# EAGLE design MobileArcade (EAGLE 9.2.1)
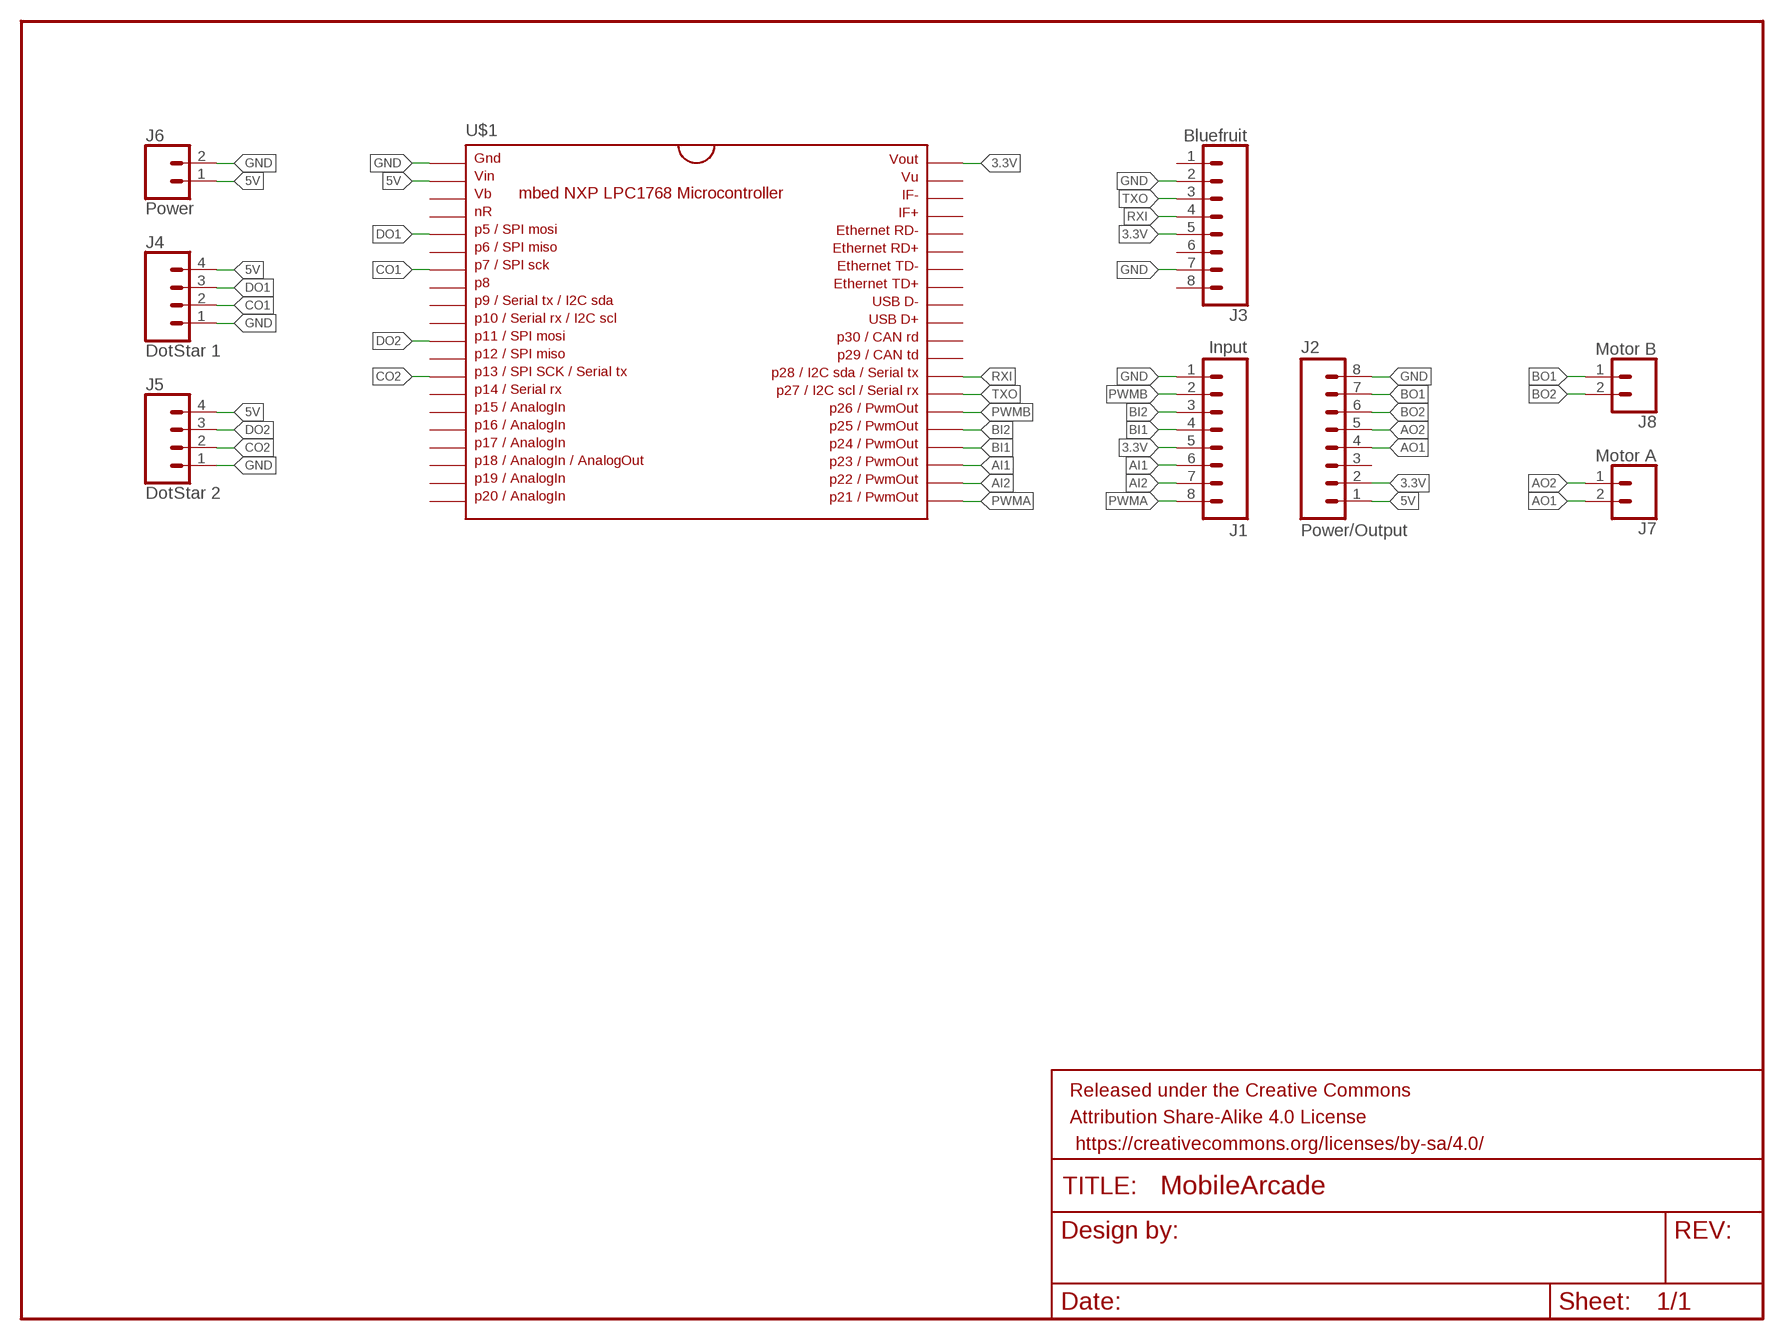
[diagram p0: schematic, sheet 1]

## Parts
FRAME1  FRAME-LETTERNO_PACKAGE  [DUMMY]
J1  Input  CONN_08"  [1X08]
J2  Power/Output  CONN_08"  [1X08]
J3  Bluefruit  CONN_08"  [1X08]
J4  DotStar 1  CONN_04  [1X04]
J5  DotStar 2  CONN_04  [1X04]
J6  Power  CONN_02  [1X02]
J7  Motor A  CONN_02  [1X02]
J8  Motor B  CONN_02  [1X02]
U$1  MBED1768  MBED_NXP_LPC1768  [DIL40_0.9]

## Nets
3.3V: J1.5 J2.2 J3.5 U$1.40
5V: J2.1 J4.4 J5.4 J6.1 U$1.2
AI1: J1.6 U$1.23
AI2: J1.7 U$1.22
AO1: J2.4 J7.2
AO2: J2.5 J7.1
BI1: J1.4 U$1.24
BI2: J1.3 U$1.25
BO1: J2.7 J8.1
BO2: J2.6 J8.2
CO1: J4.2 U$1.7
CO2: J5.2 U$1.13
DO1: J4.3 U$1.5
DO2: J5.3 U$1.11
GND: J1.1 J2.8 J3.2 J3.7 J4.1 J5.1 J6.2 U$1.1
PWMA: J1.8 U$1.21
PWMB: J1.2 U$1.26
RXI: J3.4 U$1.28
TXO: J3.3 U$1.27
Unconnected: J2.3 J3.1 J3.6 J3.8 U$1.3 U$1.4 U$1.6 U$1.8 U$1.9 U$1.10 U$1.12 U$1.14 U$1.15 U$1.16 U$1.17 U$1.18 U$1.19 U$1.20 U$1.29 U$1.30 U$1.31 U$1.32 U$1.33 U$1.34 U$1.35 U$1.36 U$1.37 U$1.38 U$1.39

## Library data of the parts
FRAME1 = SparkFun-Aesthetics:FRAME-LETTER: Schematic Frame - Letter Standard 8.5x11 US Letter frame; DESIGNER: Nobody; VERSION: v01
J1-J3 = SparkFun-Connectors:CONN_08: Multi connection point. Often used as Generic Header-pin footprint for 0.1 inch spaced/style header connections On any of the 0.1 inch spaced packages, you can populate with these: Break Away Headers - Straight <https://www.sparkfun.com/products/116> (PRT-00116) Break Away Male Headers - Right Angle <https://www.sparkfun.com/products/553> (PRT-00553) Female Headers <https://www.sparkfun.com/products/115> (PRT-00115) Break Away Headers - Machine Pin <https://www.sparkfun.com/products/117> (PRT-00117) Break Away Female Headers - Swiss Machine Pin <https://www.sparkfun.com/products/743> (PRT-00743) Arduino Stackable Header - 8 Pin <https://www.sparkfun.com/products/9279> (PRT-09279) For SCREWTERMINALS and SPRING TERMINALS visit here: Screw Terimnals on SparkFun.com <https://www.sparkfun.com/search/results?term=Screw+Terminals> (5mm/3.5mm/2.54mm spacing) This device is also useful as a general connection point to wire up your design to another part of your project. Our various solder wires solder well into these plated through hole pads. Hook-Up Wire - Assortment (Stranded, 22 AWG) <https://www.sparkfun.com/products/11375> (PRT-11375) Hook-Up Wire - Assortment (Solid Core, 22 AWG) <https://www.sparkfun.com/products/11367> (PRT-11367) View the entire wire category on our website here <https://www.sparkfun.com/categories/141> Special notes: Molex polarized connector foot print use with SKU : PRT-08231 with associated crimp pins and housings. 1MM SMD Version SKU: PRT-10208 NOTES ON THE VARIANTS LOCK and LOCK_LONGPADS... This footprint was designed to help hold the alignment of a through-hole component (i.e. 6-pin header) while soldering it into place. You may notice that each hole has been shifted either up or down by 0.005 of an inch from it's more standard position (which is a perfectly straight line). This slight alteration caused the pins (the squares in the middle) to touch the edges of the holes. Because they are alternating, it causes a "brace" to hold the component in place. 0.005 has proven to be the perfect amount of "off-center" position when using our standard breakaway headers. Although looks a little odd when you look at the bare footprint, once you have a header in there, the alteration is very hard to notice. Also,if you push a header all the way into place, it is covered up entirely on the bottom side.; PROD_ID: CONN-08438
J4 J5 = SparkFun-Connectors:CONN_04: Multi connection point. Often used as Generic Header-pin footprint for 0.1 inch spaced/style header connections On any of the 0.1 inch spaced packages, you can populate with these: Break Away Headers - Straight <https://www.sparkfun.com/products/116> (PRT-00116) Break Away Male Headers - Right Angle <https://www.sparkfun.com/products/553> (PRT-00553) Female Headers <https://www.sparkfun.com/products/115> (PRT-00115) Break Away Headers - Machine Pin <https://www.sparkfun.com/products/117> (PRT-00117) Break Away Female Headers - Swiss Machine Pin <https://www.sparkfun.com/products/743> (PRT-00743) For SCREWTERMINALS and SPRING TERMINALS visit here: Screw Terimnals on SparkFun.com <https://www.sparkfun.com/search/results?term=Screw+Terminals> (5mm/3.5mm/2.54mm spacing) This device is also useful as a general connection point to wire up your design to another part of your project. Our various solder wires solder well into these plated through hole pads. Hook-Up Wire - Assortment (Stranded, 22 AWG) <https://www.sparkfun.com/products/11375> (PRT-11375) Hook-Up Wire - Assortment (Solid Core, 22 AWG) <https://www.sparkfun.com/products/11367> (PRT-11367) View the entire wire category on our website here <https://www.sparkfun.com/categories/141> Special notes: Molex polarized connector foot print use with SKU : PRT-08231 with associated crimp pins and housings. 1MM SMD Version SKU: PRT-10208; PROD_ID: CONN-09696
J6-J8 = SparkFun-Connectors:CONN_02: Multi connection point. Often used as Generic Header-pin footprint for 0.1 inch spaced/style header connections On any of the 0.1 inch spaced packages, you can populate with these: Break Away Headers - Straight <https://www.sparkfun.com/products/116> (PRT-00116) Break Away Male Headers - Right Angle <https://www.sparkfun.com/products/553> (PRT-00553) Female Headers <https://www.sparkfun.com/products/115> (PRT-00115) Break Away Headers - Machine Pin <https://www.sparkfun.com/products/117> (PRT-00117) Break Away Female Headers - Swiss Machine Pin <https://www.sparkfun.com/products/743> (PRT-00743) For SCREWTERMINALS and SPRING TERMINALS visit here: Screw Terimnals on SparkFun.com <https://www.sparkfun.com/search/results?term=Screw+Terminals> (5mm/3.5mm/2.54mm spacing) This device is also useful as a general connection point to wire up your design to another part of your project. Our various solder wires solder well into these plated through hole pads. Hook-Up Wire - Assortment (Stranded, 22 AWG) <https://www.sparkfun.com/products/11375> (PRT-11375) Hook-Up Wire - Assortment (Solid Core, 22 AWG) <https://www.sparkfun.com/products/11367> (PRT-11367) View the entire wire category on our website here <https://www.sparkfun.com/categories/141> Special notes: Molex polarized connector foot print use with: PRT-08233 with associated crimp pins and housings. 2.54_SCREWTERM for use with PRT-10571. 3.5mm Screw Terminal footprints for PRT-08084 5mm Screw Terminal footprints for use with PRT-08432
U$1 = SparkFun-Boards:MBED_NXP_LPC1768: mbed LPC1768 board footprint Boards using this footprint: mbed - LPC1768 (Cortex-M3) (DEV-09564); PROD_ID: COMP-12167

## Board
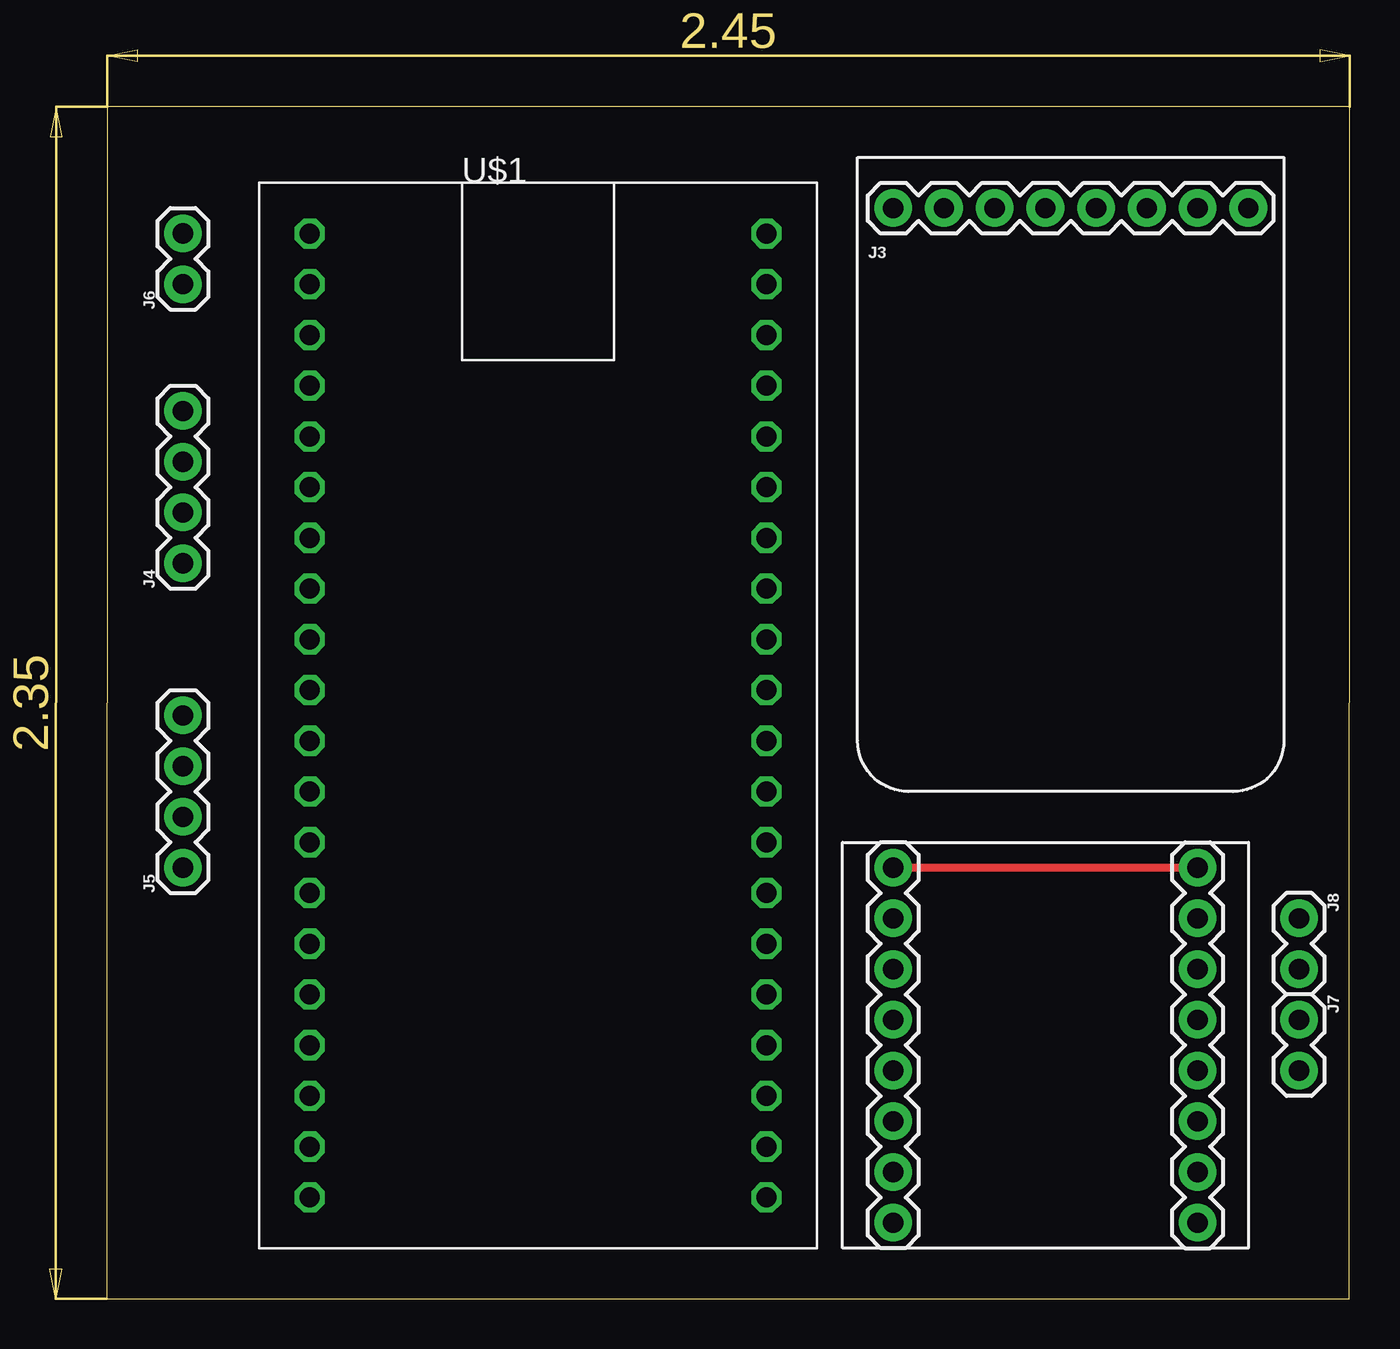
[diagram p1: board, top side]
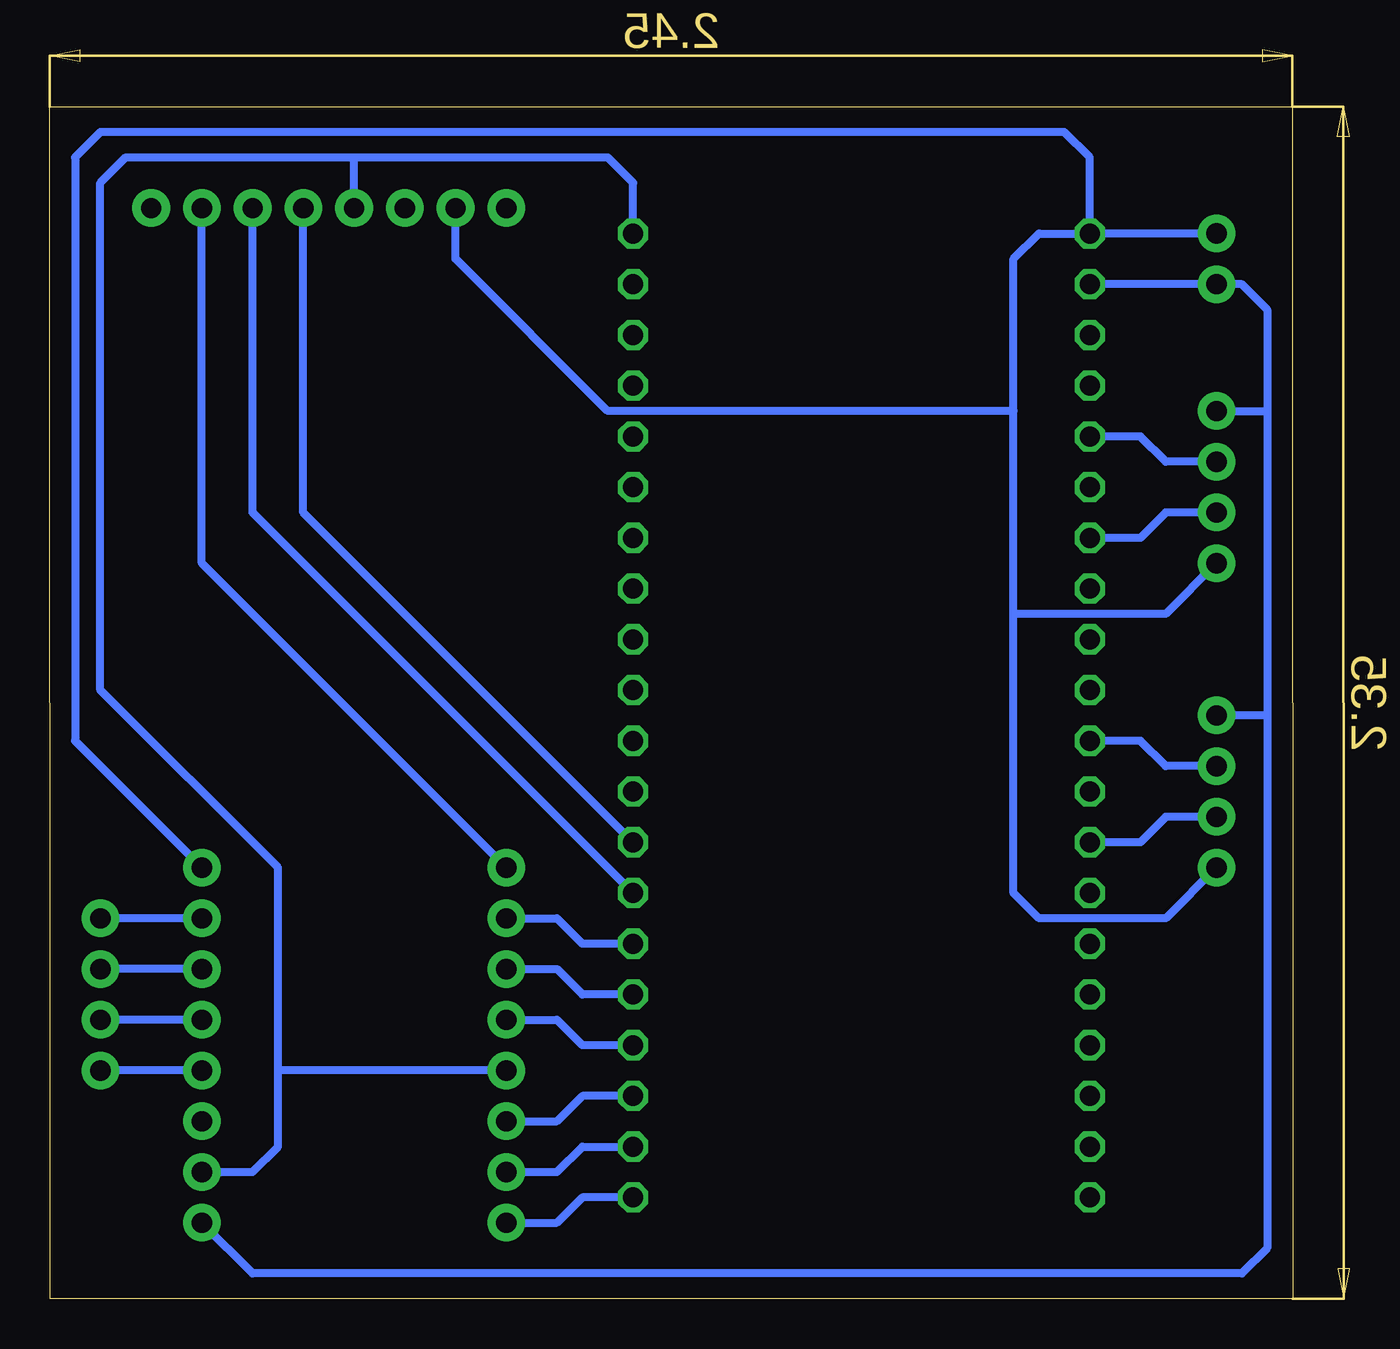
[diagram p2: board, bottom side, seen from below]

Size 62.22 x 59.69 mm. Coordinates in mm from the lower left corner, seen from the top.
Outline: 0,0 62.21,0 62.22,59.69 0.01,59.69 0,0
Copper layers (1*16): Top 0.035mm / dielectric 1.5mm / Bottom 0.035mm
Design rules "default": minimum track width 6mil, minimum drill 0.35mm, track to track 6mil, track to pad 6mil, pad to pad 6mil, via to via 6mil, smd to smd 6mil, copper to edge 40mil, drill to drill 6mil, minimum pad ring 10mil, minimum via ring 8mil, stop-mask expansion 4mil, vias tented up to drill 0mil, thermal gap 10mil

### Footprints (pad centres in the part's own frame; a part is rotated, then mirrored left to right if it is on the bottom)
1X08 = drill 1.016 pad 1.88: 1 0,0; 2 2.54,0; 3 5.08,0; 4 7.62,0; 5 10.16,0; 6 12.7,0; 7 15.24,0; 8 17.78,0
1X04 = drill 1.016 pad 1.88: 1 0,0; 2 2.54,0; 3 5.08,0; 4 7.62,0
1X02 = drill 1.016 pad 1.88: 1 0,0; 2 2.54,0
DIL40_0.9 = drill 1 pad 1.397 octagon: 1 -22.86,-11.43; 2 -20.32,-11.43; 3 -17.78,-11.43; 4 -15.24,-11.43; 5 -12.7,-11.43; 6 -10.16,-11.43; 7 -7.62,-11.43; 8 -5.08,-11.43; 9 -2.54,-11.43; 10 0,-11.43; 11 2.54,-11.43; 12 5.08,-11.43; 13 7.62,-11.43; 14 10.16,-11.43; 15 12.7,-11.43; 16 15.24,-11.43; 17 17.78,-11.43; 18 20.32,-11.43; 19 22.86,-11.43; 20 25.4,-11.43; 21 25.4,11.43; 22 22.86,11.43; 23 20.32,11.43; 24 17.78,11.43; 25 15.24,11.43; 26 12.7,11.43; 27 10.16,11.43; 28 7.62,11.43; 29 5.08,11.43; 30 2.54,11.43; 31 0,11.43; 32 -2.54,11.43; 33 -5.08,11.43; 34 -7.62,11.43; 35 -10.16,11.43; 36 -12.7,11.43; 37 -15.24,11.43; 38 -17.78,11.43; 39 -20.32,11.43; 40 -22.86,11.43

### Placement (x,y rotation side)
FRAME1  5.08,1.27 0 top
J1  39.37,21.59 270 top
J2  54.61,3.81 90 top
J3  57.15,54.61 180 top
J4  3.81,36.83 90 top
J5  3.81,21.59 90 top
J6  3.81,50.8 90 top
J7  59.69,13.97 270 top
J8  59.69,19.05 270 top
U$1  21.59,30.48 270 top

### Tracks (layer width: path | path; a pad name or v marks a point on that pad's centre or on a via)
3.3V
  Bottom 0.406: 46.99,57.15 58.42,57.15 59.69,55.88 59.69,30.48 50.8,21.59 50.8,11.43 | 46.99,57.15 34.29,57.15 33.02,55.88 U$1.40 | J3.5 46.99,57.15 | J2.2 52.07,6.35 50.8,7.62 50.8,11.43 | J1.5 50.8,11.43
5V
  Bottom 0.406: 1.27,44.45 1.27,49.53 2.54,50.8 J6.1 U$1.2 | 1.27,44.45 1.27,29.21 | 1.27,29.21 1.27,2.54 2.54,1.27 52.07,1.27 J2.1 | 1.27,29.21 J5.4 | J4.4 1.27,44.45
AI1
  Bottom 0.406: J1.6 36.83,8.89 35.56,10.16 U$1.23
AI2
  Bottom 0.406: J1.7 36.83,6.35 35.56,7.62 U$1.22
AO1
  Bottom 0.406: J2.4 J7.2
AO2
  Bottom 0.406: J2.5 J7.1
BI1
  Bottom 0.406: U$1.24 35.56,12.7 36.83,13.97 J1.4
BI2
  Bottom 0.406: U$1.25 35.56,15.24 36.83,16.51 J1.3
BO1
  Bottom 0.406: J2.7 J8.1
BO2
  Bottom 0.406: J2.6 J8.2
CO1
  Bottom 0.406: J4.2 6.35,39.37 7.62,38.1 U$1.7
CO2
  Bottom 0.406: J5.2 6.35,24.13 7.62,22.86 U$1.13
DO1
  Bottom 0.406: J4.3 6.35,41.91 7.62,43.18 U$1.5
DO2
  Bottom 0.406: J5.3 6.35,26.67 7.62,27.94 U$1.11
GND
  Top 0.406: J1.1 J2.8
  Bottom 0.406: J6.2 U$1.1 | J5.1 6.35,19.05 12.7,19.05 13.97,20.32 13.97,34.29 | 13.97,34.29 13.97,44.45 | 13.97,44.45 13.97,52.07 12.7,53.34 U$1.1 | J4.1 6.35,34.29 13.97,34.29 | 13.97,44.45 34.29,44.45 41.91,52.07 J3.7 | J3.2 54.61,36.83 J1.1 | U$1.1 10.16,57.15 11.43,58.42 59.69,58.42 60.96,57.15 60.96,27.94 J2.8
PWMA
  Bottom 0.406: J1.8 36.83,3.81 35.56,5.08 U$1.21
PWMB
  Bottom 0.406: U$1.26 35.56,17.78 36.83,19.05 J1.2
RXI
  Bottom 0.406: U$1.28 49.53,39.37 J3.4
TXO
  Bottom 0.406: U$1.27 52.07,39.37 J3.3